# Altium schematic sheet Sys_Clock.SchDoc
size A4; SheetNumber: 6; SheetTotal: 6
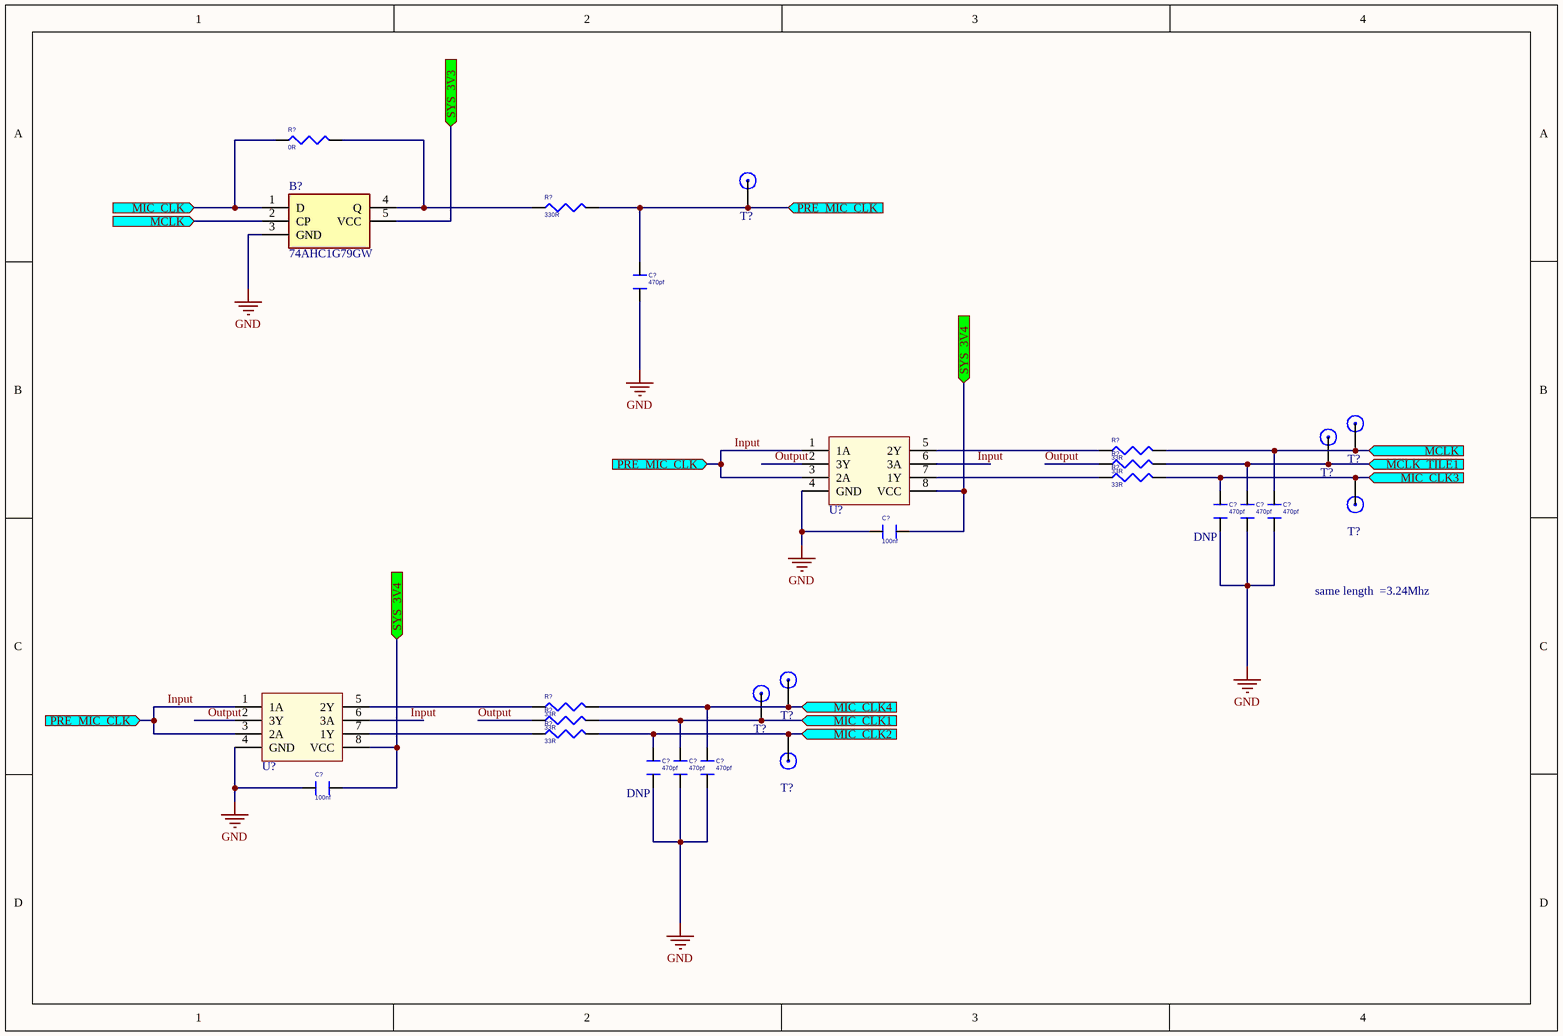
[diagram p0: Sys_Clock.SchDoc]

## Parts
(Parts that share a designator on the sheet are numbered #1, #2 ... from top to bottom, then left to right.)
B?  74AHC1G79GW  [SOT65P212X110-5N]
C?#1  470pf  [C0402]
C?#2  470pf  [C0402]
C?#3  470pf  [C0402]
C?#4  470pf  [C0402]
C?#5  100nf  [C0402]
C?#6  470pf  [C0402]
C?#7  470pf  [C0402]
C?#8  470pf  [C0402]
C?#9  100nf  [C0402]
R?#1  0R  [R 0603]
R?#2  330R  [R 0603]
R?#3  33R  [R 0603]
R?#4  33R  [R 0603]
R?#5  33R  [R 0603]
R?#6  33R  [R 0603]
R?#7  33R  [R 0603]
R?#8  33R  [R 0603]
T?#1  Test_point  [Test_point]  (value not drawn)
T?#2  Test_point  [Test_point]  (value not drawn)
T?#3  Test_point  [Test_point]  (value not drawn)
T?#4  Test_point  [Test_point]  (value not drawn)
T?#5  Test_point  [Test_point]  (value not drawn)
T?#6  Test_point  [Test_point]  (value not drawn)
T?#7  Test_point  [Test_point]  (value not drawn)
U?#1  NC7NZ34  [NC7NZ34]  (value not drawn)
U?#2  NC7NZ34  [NC7NZ34]  (value not drawn)

## Ports
MCLK (in), MCLK_TILE1 (in), MIC_CLK1 (in), MIC_CLK2 (in), MIC_CLK3 (in), MIC_CLK4 (in), MIC_CLK (in), PRE_MIC_CLK (in), SYS_3V3 (in), SYS_3V4 (in)

## Nets
GND: B?.3(GND) C?#1.1 C?#2.1 C?#3.1 C?#4.1 C?#5.2 C?#6.1 C?#7.1 C?#8.1 C?#9.2 U?#1.4(GND) U?#2.4(GND)
Input: C?#1.2 R?#2.2 T?#1.1 U?#1.1(1A) U?#1.3(2A) U?#1.6(3A) U?#2.1(1A) U?#2.3(2A) U?#2.6(3A) ; port PRE_MIC_CLK
MCLK: B?.2(CP) C?#4.2 R?#3.2 T?#2.1 ; port MCLK
MCLK_TILE1: C?#3.2 R?#4.2 T?#3.1 ; port MCLK_TILE1
MIC_CLK: B?.1(D) R?#1.1 ; port MIC_CLK
MIC_CLK1: C?#7.2 R?#7.2 T?#6.1 ; port MIC_CLK1
MIC_CLK2: C?#6.2 R?#8.2 T?#7.1 ; port MIC_CLK2
MIC_CLK3: C?#2.2 R?#5.2 T?#4.1 ; port MIC_CLK3
MIC_CLK4: C?#8.2 R?#6.2 T?#5.1 ; port MIC_CLK4
Output: R?#4.1 R?#7.1 U?#1.2(3Y) U?#2.2(3Y)
SYS_3V3: B?.5(VCC) ; port SYS_3V3
SYS_3V4: C?#5.1 C?#9.1 U?#1.8(VCC) U?#2.8(VCC) ; port SYS_3V4
NetB?_4: B?.4(Q) R?#1.2 R?#2.1
NetR?#3_1: R?#3.1 U?#1.5(2Y)
NetR?#5_1: R?#5.1 U?#1.7(1Y)
NetR?#6_1: R?#6.1 U?#2.5(2Y)
NetR?#8_1: R?#8.1 U?#2.7(1Y)

## Notes on the sheet
- (near C?#2) DNP
- same length  =3.24Mhz
- (near C?#6) DNP

## Library data of the parts
B? = 74AHC1G79GW: NXP 74AHC1G79GW, Flip Flop IC, Single Ended, 2  5.5 V, 5-Pin TSSOP; Manufacturer_Name: Nexperia; Geometry.Height: 1.1mm; Manufacturer_Part_Number: 74AHC1G79GW; Mouser Part Number: N/A; Mouser Price/Stock: https://www.mouser.com/Search/Refine.aspx?Keyword=N%2FA; Arrow Part Number: *; Arrow Price/Stock: *; Datasheet Link: https://datasheet.datasheetarchive.com/originals/distributors/Datasheets-301/11791.pdf
C?#1-C?#9 = CAP_0402: CAP ±20%/6.3V/X5R/SMT0402
R?#1-R?#8 = R_0402: RES 1/16W 5% SMT0402
U?#1 U?#2 = NC7NZ34: On_Semiconductor